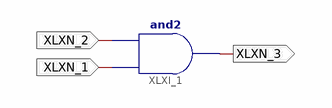
[diagram p0: schematic sheet 1]
// Xilinx ISE schematic Adder1b22.sch (kintex7) as structural Verilog: 1 symbols, 3 ports
module Adder1b22 (
  input  XLXN_1,
  input  XLXN_2,
  output XLXN_3
);

  and XLXI_1 (XLXN_3, XLXN_1, XLXN_2);
endmodule
